# EAGLE design mc_run (EAGLE 7.2.0)
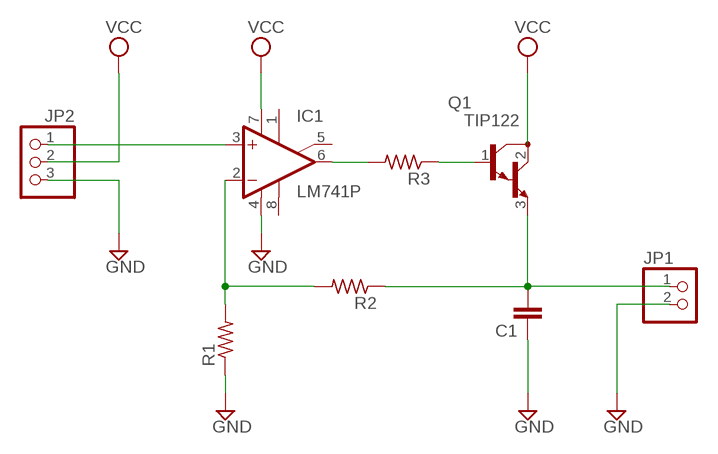
[diagram p0: schematic, sheet 1]

## Parts
C1  C7.5/3  [C7.5B3]
IC1  LM741P  [DIL08]
JP1  PINHD-1X2  [1X02]
JP2  PINHD-1X3  [1X03]
Q1  TIP122  [TO220]
R1  R-US_0411/15  [0411/15]
R2  R-US_0411/15  [0411/15]
R3  R-US_0411/15  [0411/15]

## Nets
GND: C1.1 IC1.4(V-) JP1.2 JP2.3 R1.1
N$1: IC1.3(+IN) JP2.1
N$2: IC1.6(OUT) R3.2
N$3: Q1.1(B) R3.1
N$4: C1.2 JP1.1 Q1.3(E) R2.1
N$5: IC1.2(-IN) R1.2 R2.2
VCC: IC1.7(V+) JP2.2 Q1.2(C)
Unconnected: IC1.1(ON1) IC1.5(ON2) IC1.8(OPT)

## Library data of the parts
C1 = capacitor-wima:C: CAPACITOR naming: grid - package width
IC1 = linear:*741: OP AMP
JP1 = pinhead:PINHD-1X2: PIN HEADER
JP2 = pinhead:PINHD-1X3: PIN HEADER
Q1 = transistor-npn:TIP122*: NPN Darlington Transistor
R1-R3 = resistor:R-US_: RESISTOR, American symbol

## Net classes
0 default: width 0.813 mm

## Board
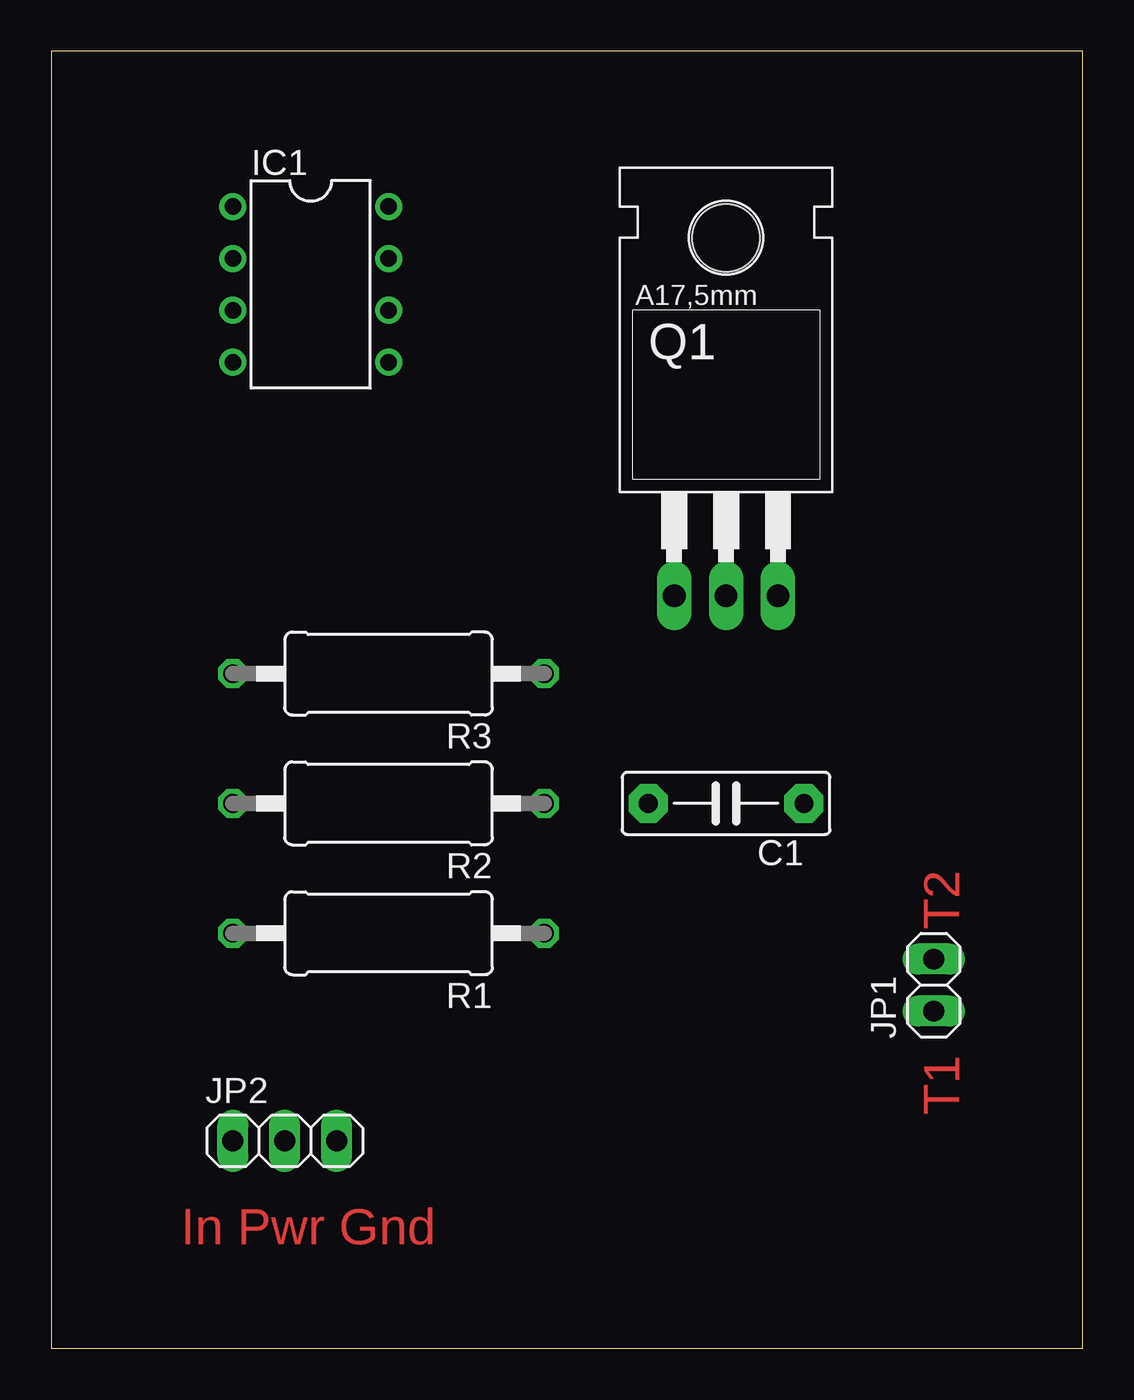
[diagram p1: board, top side]
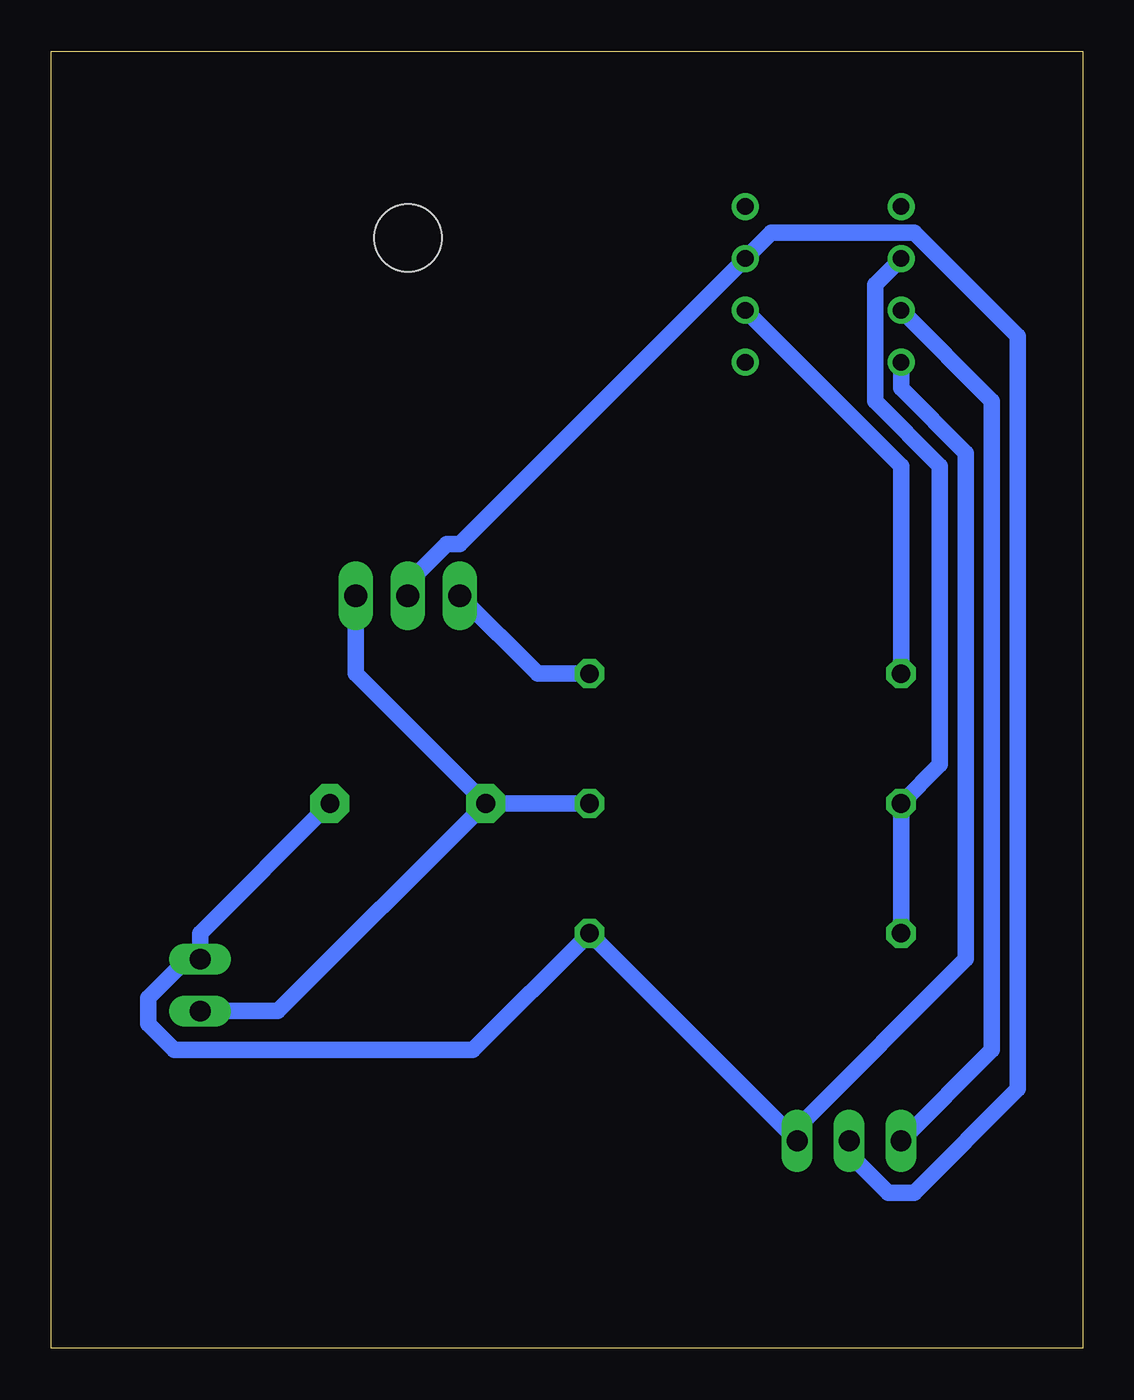
[diagram p2: board, bottom side, seen from below]

Size 50.47 x 63.49 mm. Coordinates in mm from the lower left corner, seen from the top.
Outline: 0,0 50.47,0 50.47,63.49 0,63.49 0,0
Copper layers (1*16): Top 0.035mm / dielectric 1.5mm / Bottom 0.035mm
Design rules "default": minimum track width 10mil, minimum drill 24mil, track to track 8mil, track to pad 8mil, pad to pad 8mil, via to via 8mil, smd to smd 8mil, copper to edge 40mil, drill to drill 8mil, minimum pad ring 10mil, minimum via ring 8mil, stop-mask expansion 4mil, vias tented up to drill 0mil, thermal gap 10mil

### Footprints (pad centres in the part's own frame; a part is rotated, then mirrored left to right if it is on the bottom)
C7.5B3 = drill 0.914 pad 1.905 octagon: 1 -3.81,0; 2 3.81,0
DIL08 = drill 0.813 pad 1.27: 1 -3.81,-3.81; 2 -1.27,-3.81; 3 1.27,-3.81; 4 3.81,-3.81; 5 3.81,3.81; 6 1.27,3.81; 7 -1.27,3.81; 8 -3.81,3.81
1X02 = drill 1.016 long: 1 -1.27,0; 2 1.27,0
1X03 = drill 1.016 long: 1 -2.54,0; 2 0,0; 3 2.54,0
TO220 = drill 1.118 long: 1 -2.54,-6.35; 2 0,-6.35; 3 2.54,-6.35 | hole 3.302: 0,11.176
0411/15 = drill 0.914 octagon: 1 -7.62,0; 2 7.62,0

### Placement (x,y rotation side)
C1  33.02,26.67 180 top
IC1  12.7,52.07 270 top
JP1  43.18,17.78 90 top
JP2  11.43,10.16 0 top
Q1  33.02,43.18 0 top
R1  16.51,20.32 180 top
R2  16.51,26.67 180 top
R3  16.51,33.02 180 top

### Tracks (layer width: path | path; a pad name or v marks a point on that pad's centre or on a via)
GND
  Bottom 0.813: C1.1 43.18,20.32 JP1.2 43.81,19.05 45.72,17.14 45.72,15.87 44.45,14.6 29.85,14.6 R1.1 JP2.3 13.97,10.79 5.71,19.05 5.71,43.81 8.89,46.99 IC1.4
N$1
  Bottom 0.813: IC1.3 4.44,46.36 4.44,14.6 JP2.1
N$2
  Bottom 0.813: IC1.6 8.89,43.18 R3.2
N$3
  Bottom 0.813: R3.1 26.67,33.02 Q1.1
N$4
  Bottom 0.813: C1.2 R2.1 | JP1.1 39.37,16.51 C1.2 | Q1.3 35.56,33.02 C1.2
N$5
  Bottom 0.813: IC1.2 10.16,52.07 10.16,46.36 6.99,43.18 6.99,28.57 R2.2 R1.2
VCC
  Bottom 0.813: Q1.2 33.02,37.47 31.11,39.37 30.48,39.37 IC1.7 15.24,54.61 8.25,54.61 3.18,49.53 3.18,12.7 8.25,7.62 9.53,7.62 11.43,9.52 JP2.2

### Text on the board
Top: T1 T2 | In Pwr Gnd